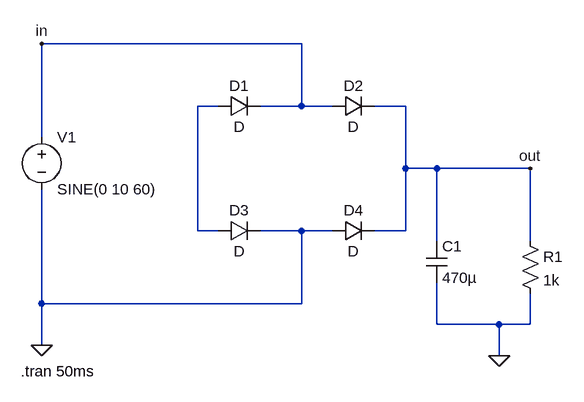
[diagram p0: schematic Full_wave_rectifier3_3.2.asc]
Full_wave_rectifier3_3.2.asc, the LTspice schematic file:
Version 4.1
SHEET 1 880 680
WIRE 288 16 -112 16
WIRE 160 112 128 112
WIRE 288 112 288 16
WIRE 288 112 224 112
WIRE 336 112 288 112
WIRE 448 112 400 112
WIRE -112 160 -112 16
WIRE 448 208 448 112
WIRE 496 208 448 208
WIRE 640 208 496 208
WIRE 128 304 128 112
WIRE 160 304 128 304
WIRE 288 304 224 304
WIRE 336 304 288 304
WIRE 448 304 448 208
WIRE 448 304 400 304
WIRE 496 320 496 208
WIRE 640 320 640 208
WIRE -112 416 -112 240
WIRE 288 416 288 304
WIRE 288 416 -112 416
WIRE 496 448 496 384
WIRE 592 448 496 448
WIRE 640 448 640 400
WIRE 640 448 592 448
WIRE -112 480 -112 416
WIRE 592 496 592 448
FLAG -112 480 0
FLAG -112 16 in
FLAG 592 496 0
FLAG 640 208 out
SYMBOL diode 160 128 R270
WINDOW 0 32 32 VTop 2
WINDOW 3 0 32 VBottom 2
SYMATTR InstName D1
SYMBOL diode 336 128 R270
WINDOW 0 32 32 VTop 2
WINDOW 3 0 32 VBottom 2
SYMATTR InstName D2
SYMBOL voltage -112 144 R0
SYMATTR InstName V1
SYMATTR Value SINE(0 10 60)
SYMBOL diode 160 320 R270
WINDOW 0 32 32 VTop 2
WINDOW 3 0 32 VBottom 2
SYMATTR InstName D3
SYMBOL diode 336 320 R270
WINDOW 0 32 32 VTop 2
WINDOW 3 0 32 VBottom 2
SYMATTR InstName D4
SYMBOL cap 480 320 R0
SYMATTR InstName C1
SYMATTR Value 470µ
SYMBOL res 624 304 R0
SYMATTR InstName R1
SYMATTR Value 1k
TEXT -144 520 Left 2 !.tran 50ms

The netlist it stands for:
* Full_wave_rectifier3_3.2.asc
D1 N001 in D
D2 in out D
V1 in 0 SINE(0 10 60)
D3 N001 0 D
D4 0 out D
C1 out 0 470µ
R1 out 0 1k
.model D D
.lib standard.dio
.tran 50ms
.backanno
.end